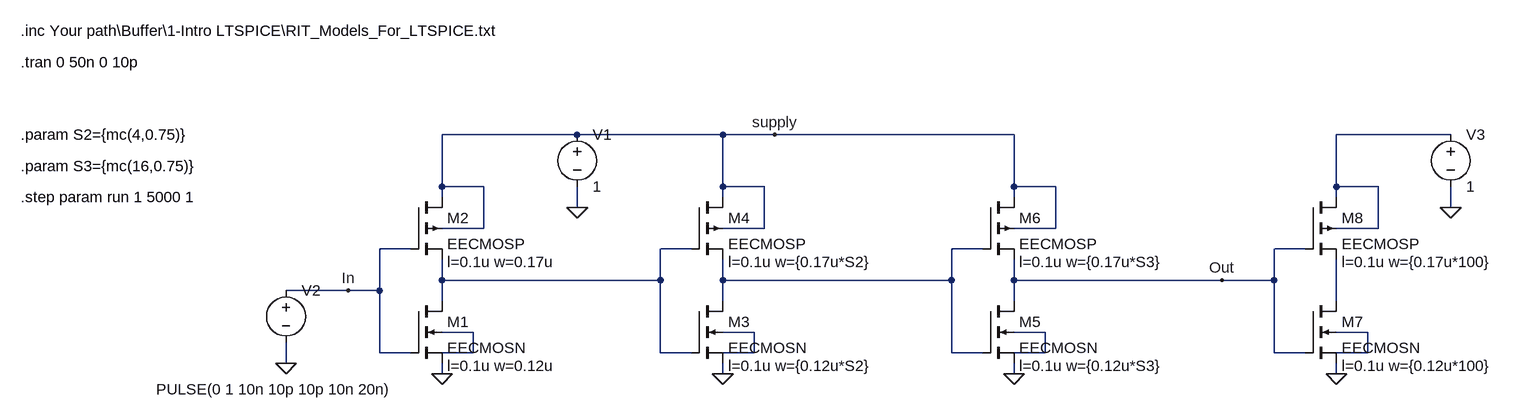
[diagram p0: schematic Buffer_MonteCarlo.asc]
Buffer_MonteCarlo.asc, the LTspice schematic file:
Version 4
SHEET 1 1884 680
WIRE 432 -64 224 -64
WIRE 656 -64 432 -64
WIRE 736 -64 656 -64
WIRE 1104 -64 736 -64
WIRE 1776 -64 1600 -64
WIRE 224 16 224 -64
WIRE 288 16 224 16
WIRE 656 16 656 -64
WIRE 720 16 656 16
WIRE 1104 16 1104 -64
WIRE 1168 16 1104 16
WIRE 1600 16 1600 -64
WIRE 1664 16 1600 16
WIRE 224 32 224 16
WIRE 656 32 656 16
WIRE 1104 32 1104 16
WIRE 1600 32 1600 16
WIRE 432 48 432 16
WIRE 1776 48 1776 16
WIRE 288 80 288 16
WIRE 288 80 224 80
WIRE 720 80 720 16
WIRE 720 80 656 80
WIRE 1168 80 1168 16
WIRE 1168 80 1104 80
WIRE 1664 80 1664 16
WIRE 1664 80 1600 80
WIRE 176 112 128 112
WIRE 608 112 560 112
WIRE 1056 112 1008 112
WIRE 1552 112 1504 112
WIRE 224 160 224 128
WIRE 560 160 560 112
WIRE 560 160 224 160
WIRE 656 160 656 128
WIRE 1008 160 1008 112
WIRE 1008 160 656 160
WIRE 1104 160 1104 128
WIRE 1424 160 1104 160
WIRE 1504 160 1504 112
WIRE 1504 160 1424 160
WIRE 80 176 -16 176
WIRE 128 176 128 112
WIRE 128 176 80 176
WIRE 224 192 224 160
WIRE 656 192 656 160
WIRE 1104 192 1104 160
WIRE 1600 192 1600 128
WIRE 272 240 224 240
WIRE 704 240 656 240
WIRE 1152 240 1104 240
WIRE 1648 240 1600 240
WIRE 128 272 128 176
WIRE 176 272 128 272
WIRE 272 272 272 240
WIRE 272 272 224 272
WIRE 560 272 560 160
WIRE 608 272 560 272
WIRE 704 272 704 240
WIRE 704 272 656 272
WIRE 1008 272 1008 160
WIRE 1056 272 1008 272
WIRE 1152 272 1152 240
WIRE 1152 272 1104 272
WIRE 1504 272 1504 160
WIRE 1552 272 1504 272
WIRE 1648 272 1648 240
WIRE 1648 272 1600 272
WIRE -16 288 -16 256
WIRE 224 304 224 288
WIRE 656 304 656 288
WIRE 1104 304 1104 288
WIRE 1600 304 1600 288
FLAG 224 304 0
FLAG 432 48 0
FLAG -16 288 0
FLAG 80 176 In
FLAG 656 304 0
FLAG 1104 304 0
FLAG 736 -64 supply
FLAG 1600 304 0
FLAG 1424 160 Out
FLAG 1776 48 0
SYMBOL nmos4 176 192 R0
WINDOW 123 56 100 Left 2
SYMATTR Value2 l=0.1u w=0.12u
SYMATTR InstName M1
SYMATTR Value EECMOSN
SYMBOL pmos4 176 32 R0
WINDOW 123 56 100 Left 2
SYMATTR Value2 l=0.1u w=0.17u
SYMATTR InstName M2
SYMATTR Value EECMOSP
SYMBOL voltage 432 -80 R0
WINDOW 123 0 0 Left 0
WINDOW 39 0 0 Left 0
SYMATTR InstName V1
SYMATTR Value 1
SYMBOL voltage -16 160 R0
WINDOW 3 -200 168 Left 2
WINDOW 123 0 0 Left 0
WINDOW 39 0 0 Left 0
SYMATTR Value PULSE(0 1 10n 10p 10p 10n 20n)
SYMATTR InstName V2
SYMBOL nmos4 608 192 R0
WINDOW 123 56 100 Left 2
SYMATTR Value2 l=0.1u w={0.12u*S2}
SYMATTR InstName M3
SYMATTR Value EECMOSN
SYMBOL pmos4 608 32 R0
WINDOW 123 56 100 Left 2
SYMATTR Value2 l=0.1u w={0.17u*S2}
SYMATTR InstName M4
SYMATTR Value EECMOSP
SYMBOL nmos4 1056 192 R0
WINDOW 123 56 100 Left 2
SYMATTR Value2 l=0.1u w={0.12u*S3}
SYMATTR InstName M5
SYMATTR Value EECMOSN
SYMBOL pmos4 1056 32 R0
WINDOW 123 56 100 Left 2
SYMATTR Value2 l=0.1u w={0.17u*S3}
SYMATTR InstName M6
SYMATTR Value EECMOSP
SYMBOL nmos4 1552 192 R0
WINDOW 123 56 100 Left 2
SYMATTR Value2 l=0.1u w={0.12u*100}
SYMATTR InstName M7
SYMATTR Value EECMOSN
SYMBOL pmos4 1552 32 R0
WINDOW 123 56 100 Left 2
SYMATTR Value2 l=0.1u w={0.17u*100}
SYMATTR InstName M8
SYMATTR Value EECMOSP
SYMBOL voltage 1776 -80 R0
SYMATTR InstName V3
SYMATTR Value 1
TEXT -424 -176 Left 2 !.tran 0 50n 0 10p
TEXT -424 -224 Left 2 !.inc Your path\\Buffer\\1-Intro LTSPICE\\RIT_Models_For_LTSPICE.txt
TEXT -424 -64 Left 2 !.param S2={mc(4,0.75)}
TEXT -424 -16 Left 2 !.param S3={mc(16,0.75)}
TEXT -424 32 Left 2 !.step param run 1 5000 1

The netlist it stands for:
* Buffer_MonteCarlo.asc
M1 N002 In 0 N005 EECMOSN l=0.1u w=0.12u
M2 supply In N002 supply EECMOSP l=0.1u w=0.17u
V1 supply 0 1
V2 In 0 PULSE(0 1 10n 10p 10p 10n 20n)
M3 N003 N002 0 N006 EECMOSN l=0.1u w={0.12u*S2}
M4 supply N002 N003 supply EECMOSP l=0.1u w={0.17u*S2}
M5 Out N003 0 N007 EECMOSN l=0.1u w={0.12u*S3}
M6 supply N003 Out supply EECMOSP l=0.1u w={0.17u*S3}
M7 N004 Out 0 N008 EECMOSN l=0.1u w={0.12u*100}
M8 N001 Out N004 N001 EECMOSP l=0.1u w={0.17u*100}
V3 N001 0 1
.model NMOS NMOS
.model PMOS PMOS
.lib standard.mos
.tran 0 50n 0 10p
.inc Your path\Buffer\1-Intro LTSPICE\RIT_Models_For_LTSPICE.txt
.param S2={mc(4,0.75)}
.param S3={mc(16,0.75)}
.step param run 1 5000 1
.backanno
.end